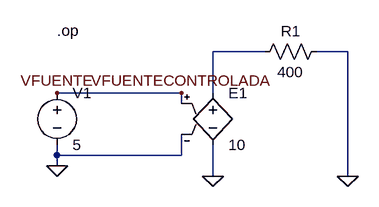
[diagram p0: schematic FTECONTROLADAasc.asc]
FTECONTROLADAasc.asc, the LTspice schematic file:
Version 4
SHEET 1 880 680
WIRE 352 48 272 48
WIRE 480 48 432 48
WIRE 224 112 32 112
WIRE 272 112 272 48
WIRE 224 128 224 112
WIRE 32 208 32 192
WIRE 224 208 224 176
WIRE 224 208 32 208
WIRE 32 224 32 208
WIRE 272 240 272 192
WIRE 480 240 480 48
FLAG 32 224 0
FLAG 272 240 0
FLAG 480 240 0
FLAG 32 112 VFUENTE
FLAG 224 112 VFUENTECONTROLADA
SYMBOL voltage 32 96 R0
SYMATTR InstName V1
SYMATTR Value 5
SYMBOL e 272 96 R0
SYMATTR InstName E1
SYMATTR Value 10
SYMBOL res 448 32 R90
WINDOW 0 0 56 VBottom 2
WINDOW 3 32 56 VTop 2
SYMATTR InstName R1
SYMATTR Value 400
TEXT 32 16 Left 2 !.op

The netlist it stands for:
* FTECONTROLADAasc.asc
V1 VFUENTECONTROLADA 0 5
E1 N001 0 VFUENTECONTROLADA 0 10
R1 0 N001 400
.op
.backanno
.end